# Altium schematic sheet VHCDI.SchDoc
size C; SheetNumber: 2; SheetTotal: 2
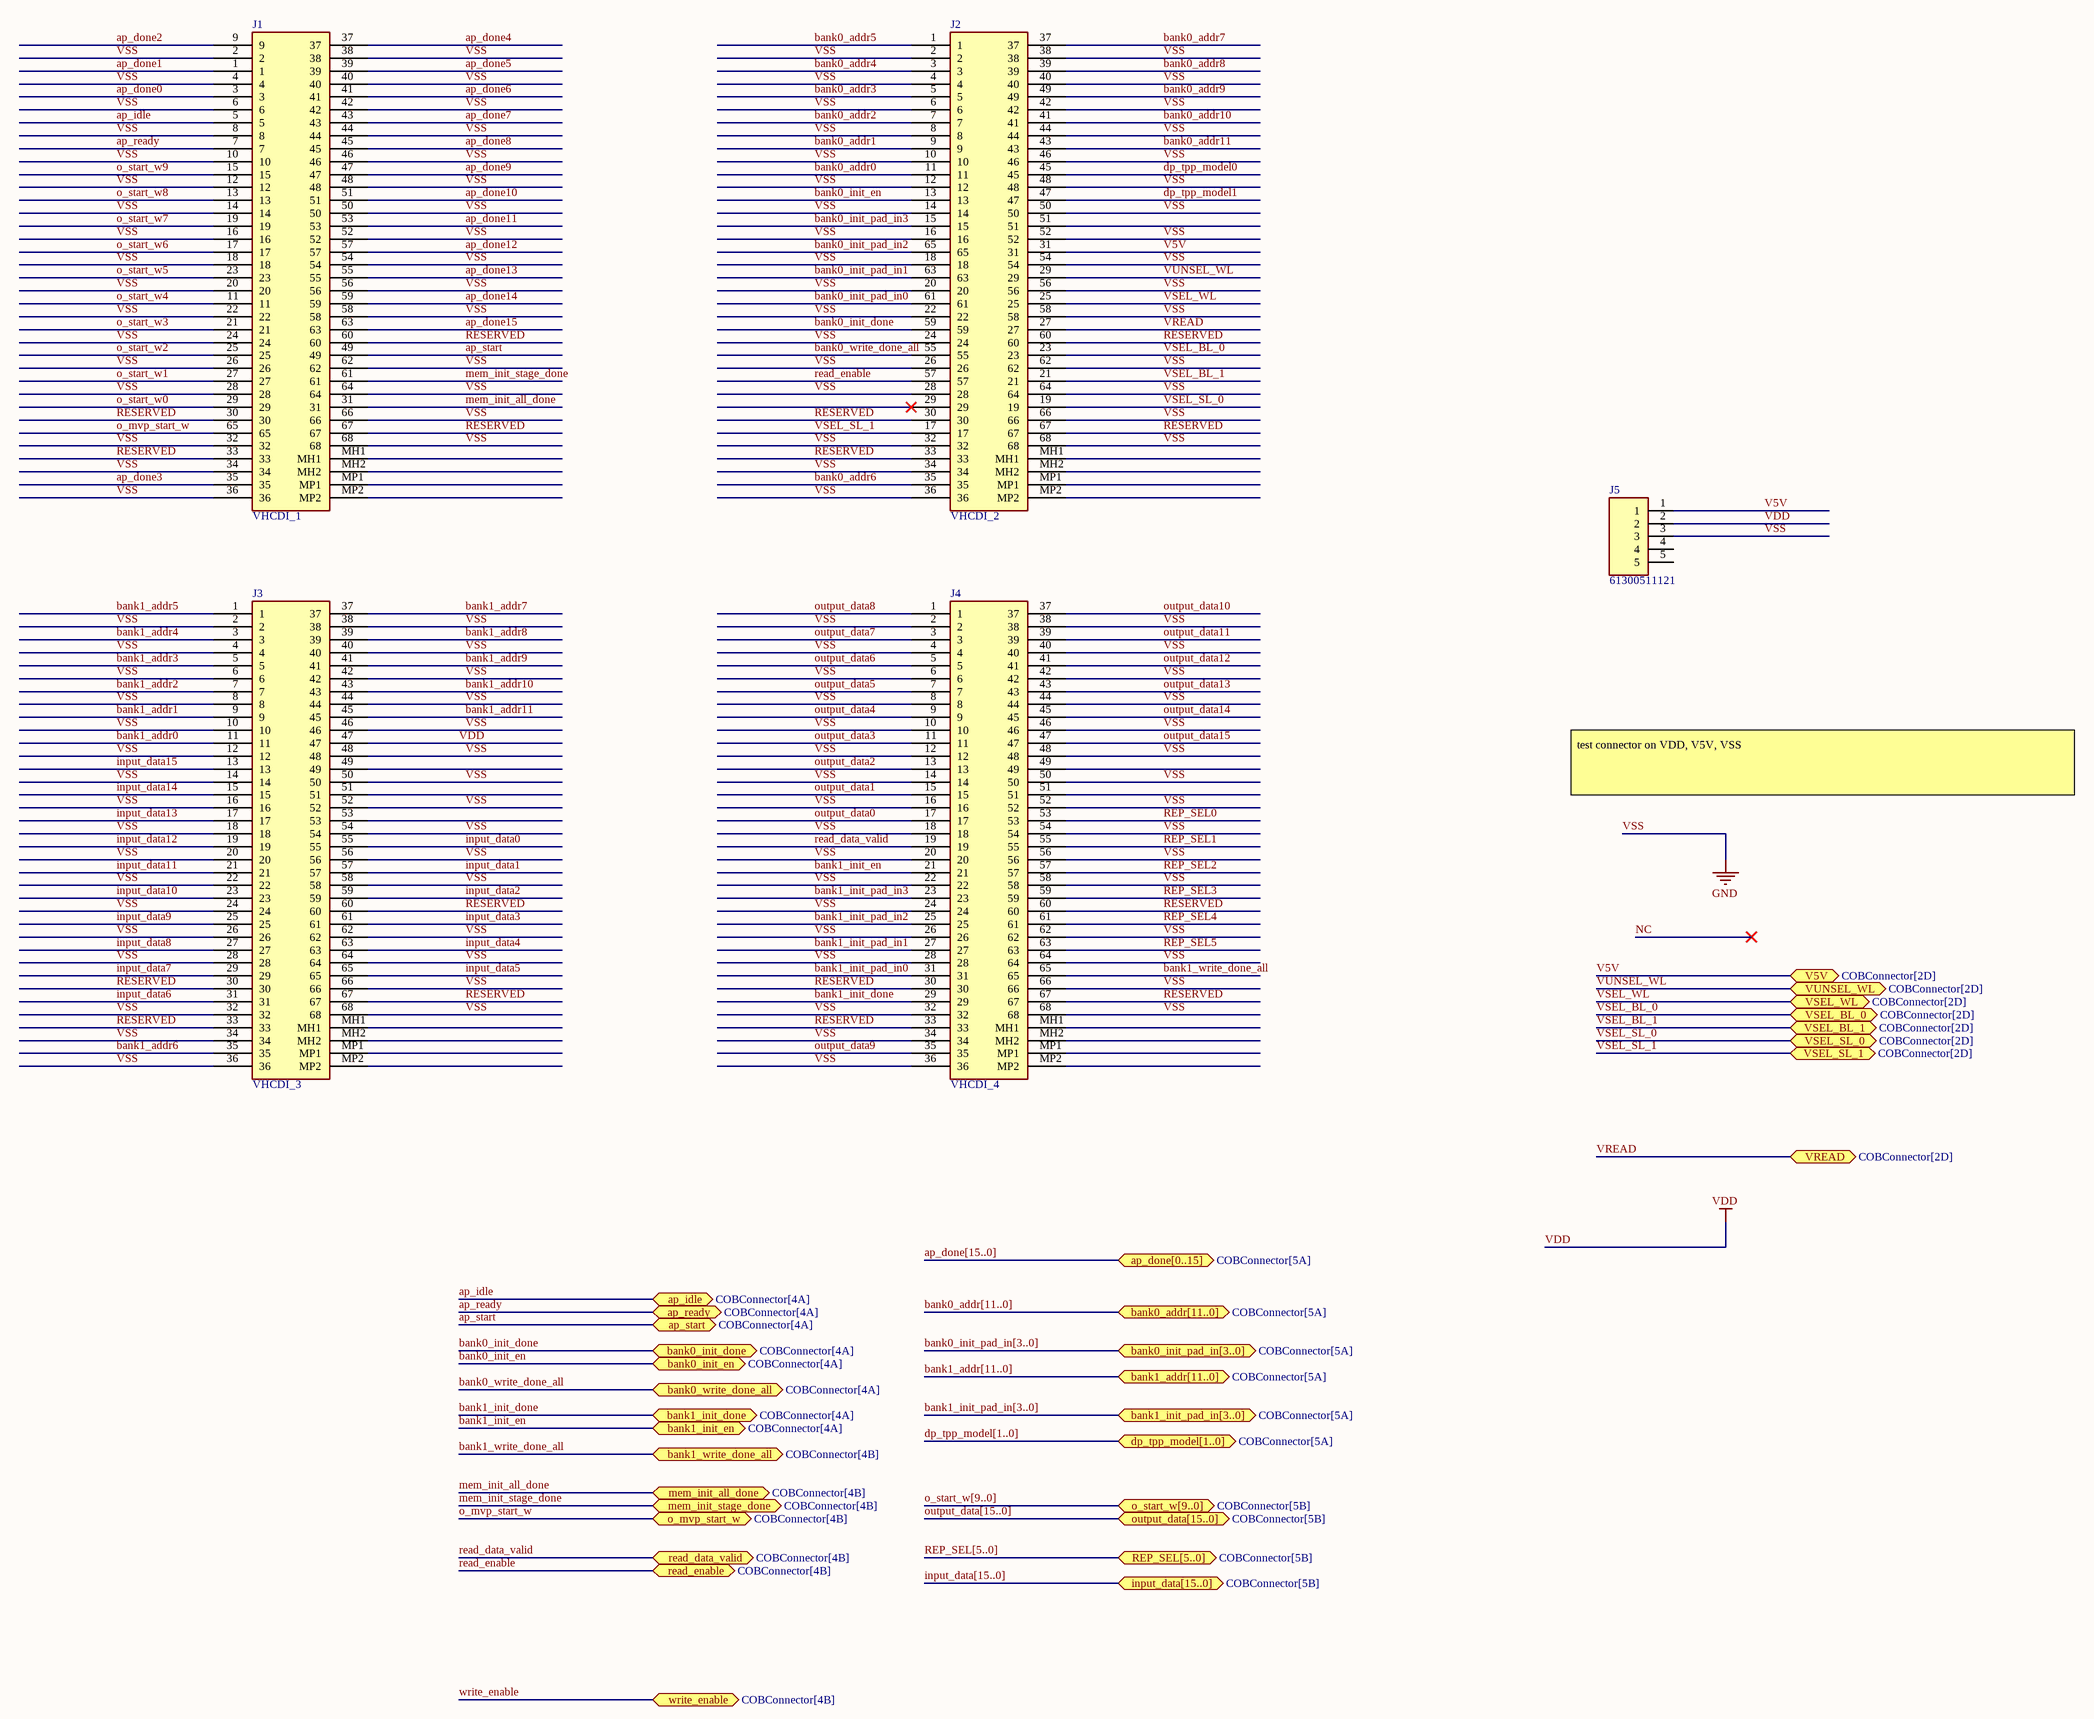
[diagram p0: VHCDI.SchDoc]

## Parts
J1  VHCDI_1  [CONN68_HDRA-EC_HON]
J2  VHCDI_2  [CONN68_HDRA-EC_HON]
J3  VHCDI_3  [CONN68_HDRA-EC_HON]
J4  VHCDI_4  [CONN68_HDRA-EC_HON]
J5  61300511121  [HDRV5W64P0X254_1X5_1270X254X854P]

## Ports
ap_done[0..15] (bidir, see COBConnector[5A]), ap_idle (bidir, see COBConnector[4A]), ap_ready (bidir, see COBConnector[4A]), ap_start (bidir, see COBConnector[4A]), bank0_addr[11..0] (bidir, see COBConnector[5A]), bank0_init_done (bidir, see COBConnector[4A]), bank0_init_en (bidir, see COBConnector[4A]), bank0_init_pad_in[3..0] (bidir, see COBConnector[5A]), bank0_write_done_all (bidir, see COBConnector[4A]), bank1_addr[11..0] (bidir, see COBConnector[5A]), bank1_init_done (bidir, see COBConnector[4A]), bank1_init_en (bidir, see COBConnector[4A]), bank1_init_pad_in[3..0] (bidir, see COBConnector[5A]), bank1_write_done_all (bidir, see COBConnector[4B]), dp_tpp_model[1..0] (bidir, see COBConnector[5A]), input_data[15..0] (bidir, see COBConnector[5B]), mem_init_all_done (bidir, see COBConnector[4B]), mem_init_stage_done (bidir, see COBConnector[4B]), o_mvp_start_w (bidir, see COBConnector[4B]), o_start_w[9..0] (bidir, see COBConnector[5B]), output_data[15..0] (bidir, see COBConnector[5B]), read_data_valid (bidir, see COBConnector[4B]), read_enable (bidir, see COBConnector[4B]), REP_SEL[5..0] (bidir, see COBConnector[5B]), V5V (bidir, see COBConnector[2D]), VREAD (bidir, see COBConnector[2D]), VSEL_BL_0 (bidir, see COBConnector[2D]), VSEL_BL_1 (bidir, see COBConnector[2D]), VSEL_SL_0 (bidir, see COBConnector[2D]), VSEL_SL_1 (bidir, see COBConnector[2D]), VSEL_WL (bidir, see COBConnector[2D]), VUNSEL_WL (bidir, see COBConnector[2D]), write_enable (bidir, see COBConnector[4B])

## Nets
VDD: J3.47 J5.2
VSS: J1.2 J1.4 J1.6 J1.8 J1.10 J1.12 J1.14 J1.16 J1.18 J1.20 J1.22 J1.24 J1.26 J1.28 J1.32 J1.34 J1.36 J1.38 J1.40 J1.42 J1.44 J1.46 J1.48 J1.50 J1.52 J1.54 J1.56 J1.58 J1.62 J1.64 J1.66 J1.68 J2.2 J2.4 J2.6 J2.8 J2.10 J2.12 J2.14 J2.16 J2.18 J2.20 J2.22 J2.24 J2.26 J2.28 J2.32 J2.34 J2.36 J2.38 J2.40 J2.42 J2.44 J2.46 J2.48 J2.50 J2.52 J2.54 J2.56 J2.58 J2.62 J2.64 J2.66 J2.68 J3.2 J3.4 J3.6 J3.8 J3.10 J3.12 J3.14 J3.16 J3.18 J3.20 J3.22 J3.24 J3.26 J3.28 J3.32 J3.34 J3.36 J3.38 J3.40 J3.42 J3.44 J3.46 J3.48 J3.50 J3.52 J3.54 J3.56 J3.58 J3.62 J3.64 J3.66 J3.68 J4.2 J4.4 J4.6 J4.8 J4.10 J4.12 J4.14 J4.16 J4.18 J4.20 J4.22 J4.24 J4.26 J4.28 J4.32 J4.34 J4.36 J4.38 J4.40 J4.42 J4.44 J4.46 J4.48 J4.50 J4.52 J4.54 J4.56 J4.58 J4.62 J4.64 J4.66 J4.68 J5.3  [also labelled GND]
ap_done0: J1.3
ap_done1: J1.1
ap_done2: J1.9
ap_done3: J1.35
ap_done4: J1.37
ap_done5: J1.39
ap_done6: J1.41
ap_done7: J1.43
ap_done8: J1.45
ap_done9: J1.47
ap_done10: J1.51
ap_done11: J1.53
ap_done12: J1.57
ap_done13: J1.55
ap_done14: J1.59
ap_done15: J1.63
ap_idle: J1.5 ; port ap_idle
ap_ready: J1.7 ; port ap_ready
ap_start: J1.49 ; port ap_start
bank0_addr0: J2.11
bank0_addr1: J2.9
bank0_addr2: J2.7
bank0_addr3: J2.5
bank0_addr4: J2.3
bank0_addr5: J2.1
bank0_addr6: J2.35
bank0_addr7: J2.37
bank0_addr8: J2.39
bank0_addr9: J2.49
bank0_addr10: J2.41
bank0_addr11: J2.43
bank0_init_done: J2.59 ; port bank0_init_done
bank0_init_en: J2.13 ; port bank0_init_en
bank0_init_pad_in0: J2.61
bank0_init_pad_in1: J2.63
bank0_init_pad_in2: J2.65
bank0_init_pad_in3: J2.15
bank0_write_done_all: J2.55 ; port bank0_write_done_all
bank1_addr0: J3.11
bank1_addr1: J3.9
bank1_addr2: J3.7
bank1_addr3: J3.5
bank1_addr4: J3.3
bank1_addr5: J3.1
bank1_addr6: J3.35
bank1_addr7: J3.37
bank1_addr8: J3.39
bank1_addr9: J3.41
bank1_addr10: J3.43
bank1_addr11: J3.45
bank1_init_done: J4.29 ; port bank1_init_done
bank1_init_en: J4.21 ; port bank1_init_en
bank1_init_pad_in0: J4.31
bank1_init_pad_in1: J4.27
bank1_init_pad_in2: J4.25
bank1_init_pad_in3: J4.23
bank1_write_done_all: J4.65 ; port bank1_write_done_all
dp_tpp_model0: J2.45
dp_tpp_model1: J2.47
input_data0: J3.55
input_data1: J3.57
input_data2: J3.59
input_data3: J3.61
input_data4: J3.63
input_data5: J3.65
input_data6: J3.31
input_data7: J3.29
input_data8: J3.27
input_data9: J3.25
input_data10: J3.23
input_data11: J3.21
input_data12: J3.19
input_data13: J3.17
input_data14: J3.15
input_data15: J3.13
mem_init_all_done: J1.31 ; port mem_init_all_done
mem_init_stage_done: J1.61 ; port mem_init_stage_done
o_mvp_start_w: J1.65 ; port o_mvp_start_w
o_start_w0: J1.29
o_start_w1: J1.27
o_start_w2: J1.25
o_start_w3: J1.21
o_start_w4: J1.11
o_start_w5: J1.23
o_start_w6: J1.17
o_start_w7: J1.19
o_start_w8: J1.13
o_start_w9: J1.15
output_data0: J4.17
output_data1: J4.15
output_data2: J4.13
output_data3: J4.11
output_data4: J4.9
output_data5: J4.7
output_data6: J4.5
output_data7: J4.3
output_data8: J4.1
output_data9: J4.35
output_data10: J4.37
output_data11: J4.39
output_data12: J4.41
output_data13: J4.43
output_data14: J4.45
output_data15: J4.47
read_data_valid: J4.19 ; port read_data_valid
read_enable: J2.57 ; port read_enable
REP_SEL0: J4.53
REP_SEL1: J4.55
REP_SEL2: J4.57
REP_SEL3: J4.59
REP_SEL4: J4.61
REP_SEL5: J4.63
RESERVED: J1.30 J1.33 J1.60 J1.67 J2.30 J2.33 J2.60 J2.67 J3.30 J3.33 J3.60 J3.67 J4.30 J4.33 J4.60 J4.67
V5V: J2.31 J5.1 ; port V5V
VREAD: J2.27 ; port VREAD
VSEL_BL_0: J2.23 ; port VSEL_BL_0
VSEL_BL_1: J2.21 ; port VSEL_BL_1
VSEL_SL_0: J2.19 ; port VSEL_SL_0
VSEL_SL_1: J2.17 ; port VSEL_SL_1
VSEL_WL: J2.25 ; port VSEL_WL
VUNSEL_WL: J2.29 ; port VUNSEL_WL
write_enable: port write_enable

Not connected (* = marked no-connect by the designer): J1 MH1 MH2 MP1 MP2; J2 51 MH1 MH2 MP1 MP2; J3 49 51 53 MH1 MH2 MP1 MP2; J4 49 51 MH1 MH2 MP1 MP2; J5 4 5

## Buses and harness runs
bus ap_done[15..0] = port ap_done[0..15]
bus bank0_addr[11..0] = port bank0_addr[11..0]
bus bank0_init_pad_in[3..0] = port bank0_init_pad_in[3..0]
bus bank1_addr[11..0] = port bank1_addr[11..0]
bus bank1_init_pad_in[3..0] = port bank1_init_pad_in[3..0]
bus dp_tpp_model[1..0] = port dp_tpp_model[1..0]
bus input_data[15..0] = port input_data[15..0]
bus o_start_w[9..0] = port o_start_w[9..0]
bus output_data[15..0] = port output_data[15..0]
bus REP_SEL[5..0] = port REP_SEL[5..0]

## Notes on the sheet
- test connector on VDD, V5V, VSS

## Library data of the parts
J1-J4 = 785633-01: Connector; Manufacturer_Name: NI; Datasheet Link: https://www.digikey.com/en/products/detail/ni/785633-01/16637125?s=N4IgTCBcDaIOwA4CsA2AzGkBdAvkA; Height: 10.8mm; Manufacturer_Part_Number: 785633-01
J5 = 61300511121: Connector; Manufacturer_Name: Wurth Elektronik; Datasheet Link: http://katalog.we-online.de/em/datasheet/6130xx11121.pdf; Height: 8.54mm; Manufacturer_Part_Number: 61300511121; Mouser Part Number: 710-61300511121; Mouser Price/Stock: https://www.mouser.co.uk/ProductDetail/Wurth-Elektronik/61300511121?qs=PhR8RmCirEZCsCRHq%252BvfRQ%3D%3D